# Altium project WR_NIC.PrjPcb (part 4 of 6)

## Sheet 12-USB Phy.SchDoc
size C; SheetNumber: 12; SheetTotal: 22
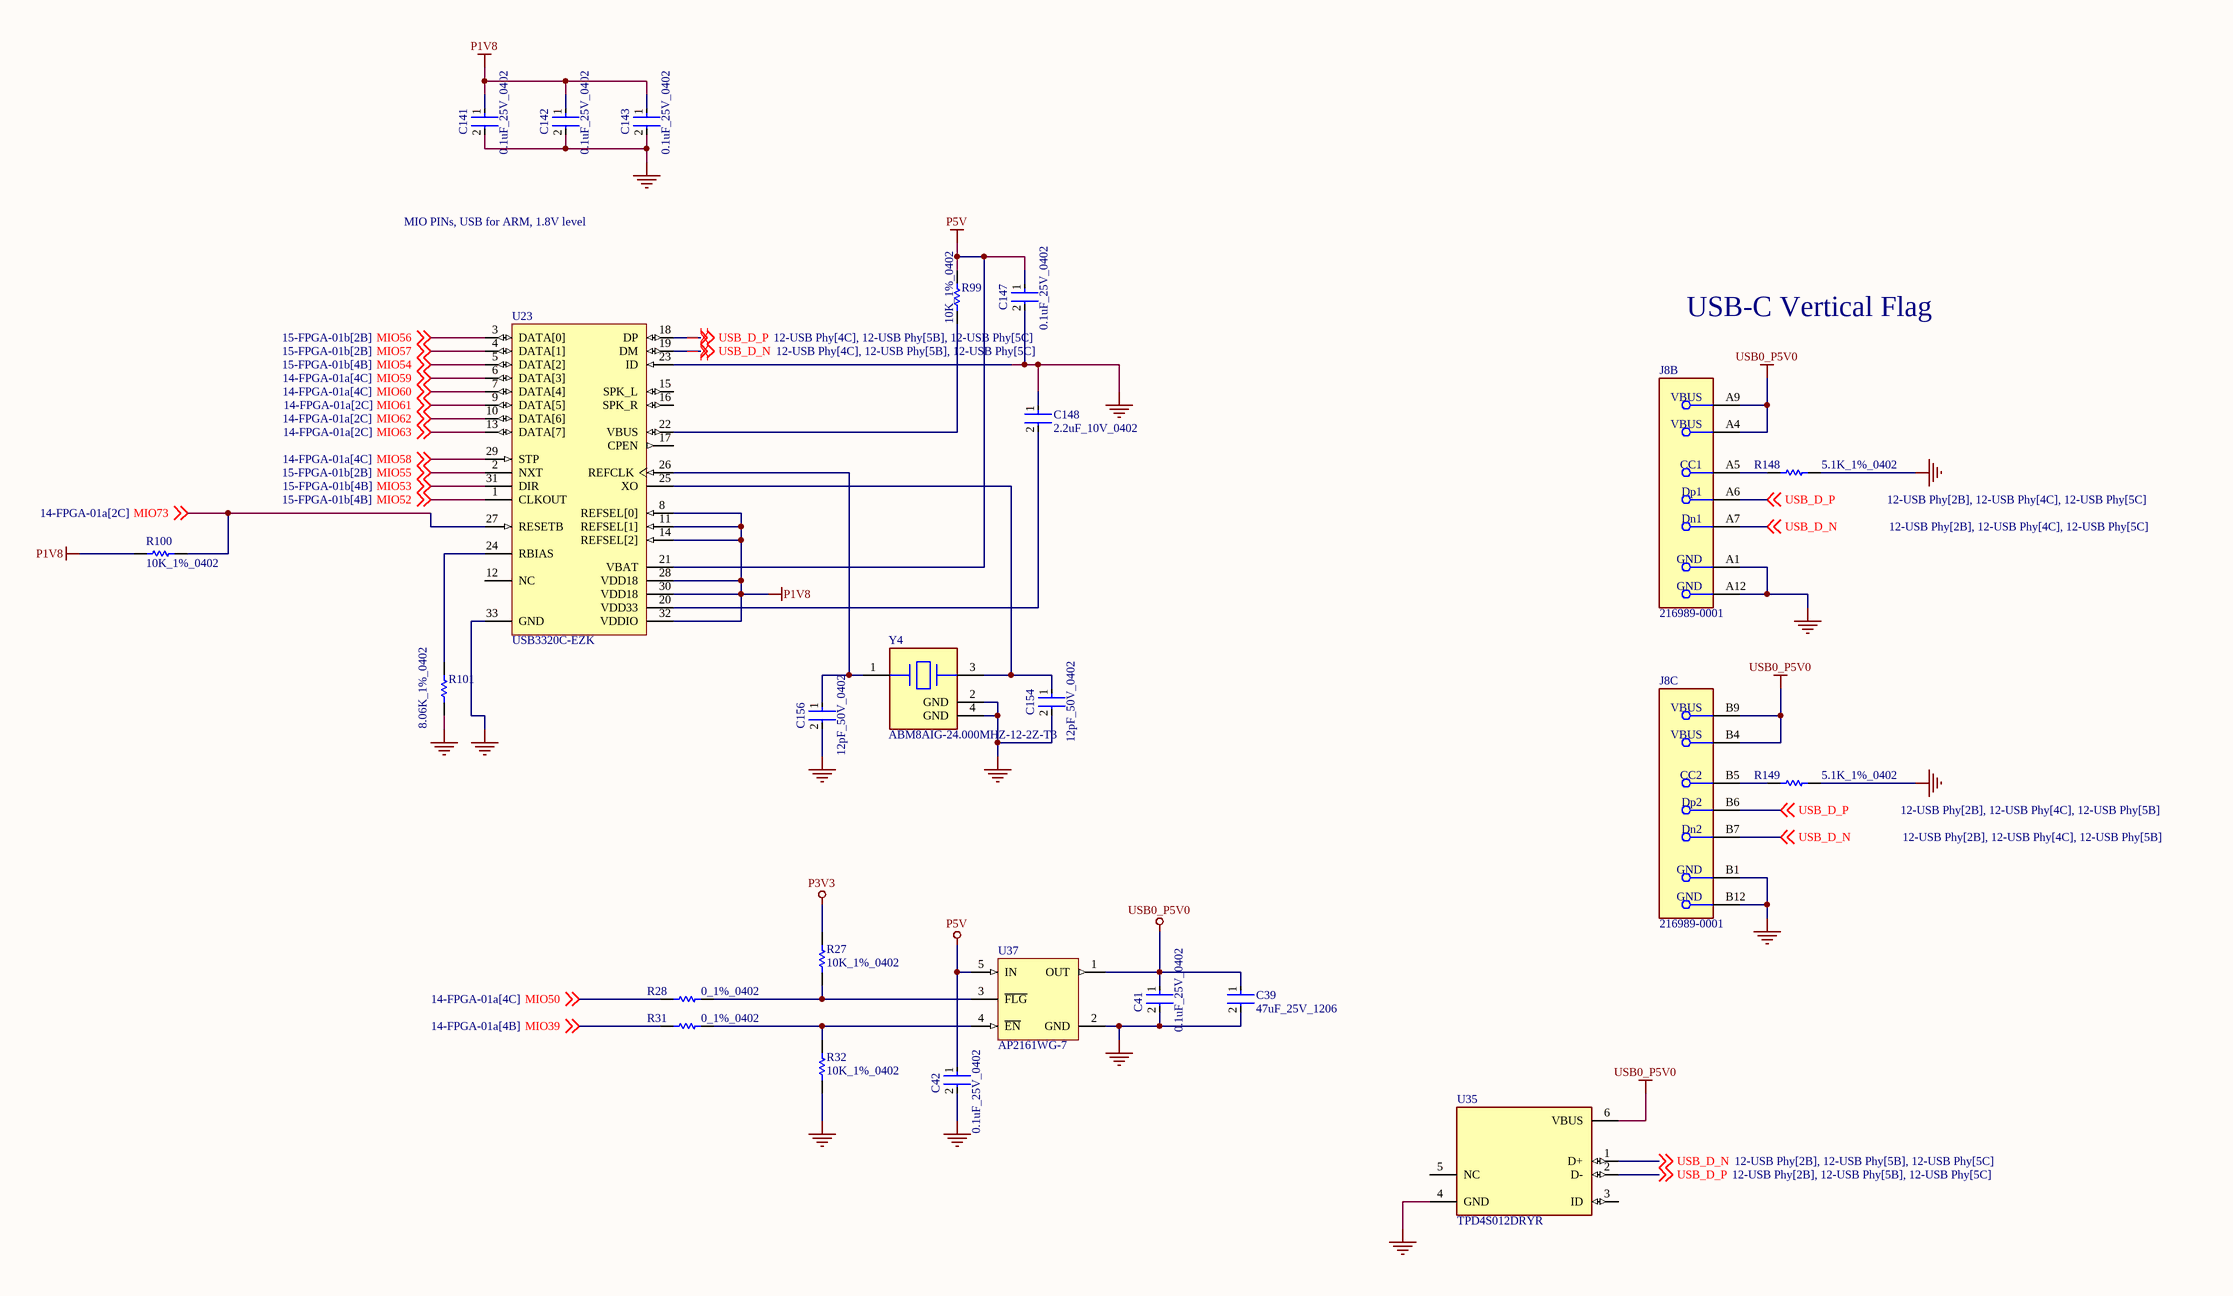
[diagram p12: 12-USB Phy.SchDoc]

### Parts
C39  47uF_25V_1206  [FP-C3216-160-0_2-MFG]
C41  0.1uF_25V_0402  [FP-0402-L_1_0_1-W_0_5_0_1-IPC_C]
C42  0.1uF_25V_0402  [FP-0402-L_1_0_1-W_0_5_0_1-IPC_C]
C141  0.1uF_25V_0402  [FP-0402-L_1_0_1-W_0_5_0_1-IPC_C]
C142  0.1uF_25V_0402  [FP-0402-L_1_0_1-W_0_5_0_1-IPC_C]
C143  0.1uF_25V_0402  [FP-0402-L_1_0_1-W_0_5_0_1-IPC_C]
C147  0.1uF_25V_0402  [FP-0402-L_1_0_1-W_0_5_0_1-IPC_C]
C148  2.2uF_10V_0402  [FP-C1005-050-0_15-0_1-MFG]
C154  12pF_50V_0402  [FP-0402-L_1_0_1-W_0_5_0_1-IPC_B]
C156  12pF_50V_0402  [FP-0402-L_1_0_1-W_0_5_0_1-IPC_B]
J8  216989-0001  [FP-216989-0001-MFG]  (parts B,C of 3)
R27  10K_1%_0402  [RESC1005X40X25NL10T10]
R28  0_1%_0402  [RESC1005X40X25LL05T05]
R31  0_1%_0402  [RESC1005X40X25LL05T05]
R32  10K_1%_0402  [RESC1005X40X25NL10T10]
R99  10K_1%_0402  [RESC1005X40X25NL10T10]
R100  10K_1%_0402  [RESC1005X40X25NL10T10]
R101  8.06K_1%_0402  [RESC1005X40X25ML05T05]
R148  5.1K_1%_0402  [RESC1005X40X25ML10T10]
R149  5.1K_1%_0402  [RESC1005X40X25ML10T10]
U23  USB3320C-EZK  [MCHP-QFN-32-5x5_V2]
U35  TPD4S012DRYR  [FP-DRY0006A-MFG]
U37  AP2161WG-7  [DIOD-SOT25-5_V]
Y4  ABM8AIG-24.000MHZ-12-2Z-T3  [FP-ABM8AIG-MFG]

### Nets
GND: C39.2 C41.2 C42.2 C141.2 C142.2 C143.2 C147.2 C148.1 C154.2 C156.2 J8.A1(GND) J8.A12(GND) J8.B1(GND) J8.B12(GND) R32.1 R101.1 R148.2 R149.2 U23.23(ID) U23.33(GND) U35.4(GND) U37.2(GND) Y4.2(GND) Y4.4(GND)
P1V8: C141.1 C142.1 C143.1 R100.1 U23.8(REFSEL[0]) U23.11(REFSEL[1]) U23.14(REFSEL[2]) U23.28(VDD18) U23.30(VDD18) U23.32(VDDIO)
P3V3: R27.2
P5V: C42.1 C147.1 R99.2 U23.21(VBAT) U37.5(IN)
USB0_P5V0: C39.1 C41.1 J8.A4(VBUS) J8.A9(VBUS) J8.B4(VBUS) J8.B9(VBUS) U35.6(VBUS) U37.1(OUT)
MIO39: R31.1 ; off-sheet MIO39
MIO50: R28.1 ; off-sheet MIO50
MIO52: U23.1(CLKOUT) ; off-sheet MIO52
MIO53: U23.31(DIR) ; off-sheet MIO53
MIO54: U23.5(DATA[2]) ; off-sheet MIO54
MIO55: U23.2(NXT) ; off-sheet MIO55
MIO56: U23.3(DATA[0]) ; off-sheet MIO56
MIO57: U23.4(DATA[1]) ; off-sheet MIO57
MIO58: U23.29(STP) ; off-sheet MIO58
MIO59: U23.6(DATA[3]) ; off-sheet MIO59
MIO60: U23.7(DATA[4]) ; off-sheet MIO60
MIO61: U23.9(DATA[5]) ; off-sheet MIO61
MIO62: U23.10(DATA[6]) ; off-sheet MIO62
MIO63: U23.13(DATA[7]) ; off-sheet MIO63
MIO73: R100.2 U23.27(RESETB) ; off-sheet MIO73
USB_D_N: J8.A7(Dn1) J8.B7(Dn2) U23.19(DM) U35.1(D+) ; off-sheet USB_D_N
USB_D_P: J8.A6(Dp1) J8.B6(Dp2) U23.18(DP) U35.2(D-) ; off-sheet USB_D_P
NetC148_2: C148.2 U23.20(VDD33)
NetC154_1: C154.1 U23.25(XO) Y4.3
NetC156_1: C156.1 U23.26(REFCLK) Y4.1
NetJ8_A5: J8.A5(CC1) R148.1
NetJ8_B5: J8.B5(CC2) R149.1
NetR27_1: R27.1 R28.2 U37.3(~{FLG})
NetR31_2: R31.2 R32.2 U37.4(~{EN})
NetR99_1: R99.1 U23.22(VBUS)
NetR101_2: R101.2 U23.24(RBIAS)

Not connected (* = marked no-connect by the designer): U23 12(NC) 15(SPK_L) 16(SPK_R) 17(CPEN); U35 3(ID) 5(NC)

### Layout directives
differential pair: USB_D_N, USB_D_P

### Notes on the sheet
- MIO PINs, USB for ARM, 1.8V level
- USB-C Vertical Flag

### Library data of the parts
C39 = CMP-2000-05397-3: Multilayer Ceramic Capacitors 47uF ±20% 25V X5R SMD 1206; Weight: 0.000571oz; Dielectric: X5R; Length: 0.126inch; Voltage Rating: 25V; Case/Package: 1206; Dielectric Material: Ceramic; Min Operating Temperature: -55°C; Lead Free: Lead Free; Packaging: Tape and Reel; Package Quantity: 1; Mount: Surface Mount; Depth: 1.6mm; REACH SVHC: No SVHC; Termination: SMD/SMT; Case Code (Imperial): 1206; Series: C; Resistor Type: Ceramic; Voltage: 25V; Width: 0.063inch; Height: 1.6mm; Tolerance: 20%; Capacitance: 47uF; Max Operating Temperature: 85°C; Voltage Rating (DC): 25V; RoHS Compliant: Yes; Thickness: 0.071inch; Case Code (Metric): 3216
C41 C42 C141-C143 C147 = CMP-2008-02519-2: as C91 on sheet 10-JTAG; Package Quantity: 1; Capacitance: 100nF; Min Operating Temperature: -55°C; Voltage: 25V; Voltage Rating: 25V; Construction: Flat; Max Operating Temperature: 125°C; Radiation Hardening: No; Depth: 0.5mm; Thickness: 0.022inch; Voltage Rating (DC): 25V; Number of Pins: 2; Lead Free: Lead Free; Series: -; REACH SVHC: No SVHC; Length: 1mm; Dielectric: X7R; RoHS Compliant: Yes; Mount: Surface Mount; Packaging: Tape and Reel; Case/Package: 0402; Case Code (Imperial): 0402; Termination: SMD/SMT; Width: 0.02inch; Case Code (Metric): 1005; Tolerance: 10%
C148 = CMP-08246-004344-1: CAP CER 2.2UF 10V X7S 0402; Dielectric Material: Ceramic; Tolerance: 10%; Mount: Surface Mount; Height: 0.5mm; Package Quantity: 1; Depth: 0.5mm; RoHS Compliant: Yes; Length: 1mm; Thickness: 0.022inch; Packaging: Tape and Reel; Capacitance: 2.2uF; Case Code (Imperial): 0402; Resistor Type: Ceramic; Dielectric: X7S; Case/Package: 0402; Min Operating Temperature: -55°C; Voltage Rating: 10V; Series: C; Weight: 2.3E-05oz; Width: 0.02inch; Voltage Rating (DC): 10V; Case Code (Metric): 1005; Max Operating Temperature: 125°C; Termination: SMD/SMT; Lead Free: Lead Free
C154 C156 = CMP-2008-02574-2: General Purpose Ceramic Capacitor, 0402, 12pF, 5%, C0G, 30ppm/°C, 50V; Insulation Resistance: 100GR; Radiation Hardening: No; RoHS Compliant: Yes; Voltage Rating: 50V; Case Code (Imperial): 0402; Height: 0.5mm; Voltage: 50V; Voltage Rating (DC): 50V; Mount: Surface Mount; Capacitance: 12pF; Thickness: 0.022inch; Depth: 0.5mm; Max Operating Temperature: 125°C; Construction: Flat; Termination: SMD/SMT; Tolerance: 5%; Length: 1mm; Lead Free: Lead Free; Dielectric: C0G; Number of Pins: 2; Package Quantity: 1; Series: -; Temperature Coefficient: 30ppm/°C; Min Operating Temperature: -55°C; Case/Package: 0402; Packaging: Tape and Reel; Case Code (Metric): 1005; Width: 0.02inch; REACH SVHC: No SVHC
J8 = CMP-04767-000020-1: CONN RCPT USB2.0 TYPE C 24POS RA
R27 R32 R99 R100 = CMP-2002-04694-1: Manufacturer: Bourns; Part Number: CR0402-FX-1002GLF
R28 R31 = CMP-2000-07451-1: as R197-R199 on sheet 09-DPLL-3; Number of Terminations: 2; Mount: SurfaceMount; Height: 0.35mm; Packaging: TapeandReel; Contact Plating: Tin; Manufacturer URL: http://www.panasonic.com/; Composition: ThickFilm; Max Operating Temperature: 155degC; REACH SVHC: NoSVHC; Case/Package: 0402; Package Reference: 402; Depth: 0.5mm; Package Description: 2-Pin Surface Mount Device, Body 1 x 0.5 mm; Datasheet URL: https://industrial.panasonic.com/cdbs/www-data/pdf/RDA0000/AOA0000C301.pdf; RoHSCompliant: True; Case Code (Imperial): 0402; Military Standard: Not; Min Operating Temperature: -55degC; Power Rating: 100mW; Datasheet Version: 03/2015; Length: 1mm; Case Code (Metric): 1005; Termination: SMD/SMT; Mounting Technology: SurfaceMount; Voltage Rating: 50V; Width: 0.02inch; Package Quantity: 1; Lead Free: LeadFree; Radiation Hardening: No
R101 = CMP-2002-00253-3: Chip Resistor, 8.06 KOhm, +/- 1%, 63 mW, -55 to 155 degC, 0402 (1005 Metric), RoHS, Tape and Reel; PartNumber: CRCW04028K06FKED; Manufacturer: Basic Passives; Case\/Package: 0402; Power Rating: 63 mW; Voltage Rating: 50 V; PackageReference: 0402; Radiation Hardening: No; Package Quantity: 10000; Height: 0.35 mm; Packaging: Tape and Reel; Mount: Surface Mount; Length: 1 mm; Weight: 2.3E-05oz; Case Code (Metric): 1005; DatasheetVersion: 06/2012; Pins: 2; Min Operating Temperature: -55 degC; Case Code (Imperial): 0402; REACH SVHC: Unknown; Tolerance: 1%; Mounting Technology: Surface Mount; ComponentLink1URL: http://www.vishay.com/; ComponentLink2URL: http://www.vishay.com/docs/20035/dcrcwe3.pdf; ComponentLink2Description: Datasheet; Resistance: 8.06 KOhm; Max Operating Temperature: 155 degC; ComponentLink1Description: Manufacturer URL; Width: 0.5 mm; RoHSCompliant: true; PackageDescription: 2-Pin Surface Mount Device, Body 1 x 0.5 mm
R148 R149 = CMP-2002-04046-1: as R21 on sheet 10-JTAG
U23 = CMP-0186-00335-1: Highly Integrated Full Featured Hi-Speed USB 2.0 ULPI Transceiver, 1.8 to 3.3 V, -40 to 85 degC, 32-Pin QFN (QFN-3304), RoHS, Tray; Manufacturer: Microchip; VVBAT: 3.1 to 5.5 V; REFCLK Frequency@ULPI Input Clock Mode: 60 MHz; Cpin: 4 pF Max.; VDD33: 3 to 3.6 V; Mounting Technology: Surface Mount; I/O Voltage: 1.8 to 3.3 V; ComponentLink3URL: http://ww1.microchip.com/downloads/en/DeviceDoc/00001792A.pdf; PackageDescription: 32-Pin Quad Flat Non-Leaded Package, Body 5 x 5 mm, Pitch 0.5 mm; ComponentLink2URL: http://ww1.microchip.com/downloads/en/DeviceDoc/00001792A.pdf; Temperature Range: -40 to 85 degC; ComponentLink2Description: Datasheet; ComponentLink1URL: www.microchip.com/; ComponentLink3Description: Package Specification; Packing: Tray; ComponentLink1Description: Manufacturer URL; PartNumber: USB3320C-EZK; PackageVersion: Rev. H; DatasheetVersion: DS00001792A; RoHS: TRUE
U35 = CMP-0326-00038-4: as U33 on sheet 10-JTAG; Max Operating Temperature: 85°C; Packaging: Tape and Reel; Termination: SMD/SMT; Number of Pins: 6; Radiation Hardening: No; Width: 1.05mm; REACH SVHC: No SVHC; Lead Free: Lead Free; Depth: 1mm; Package Quantity: 5000; Length: 1.45mm; Direction: Unidirectional; Min Operating Temperature: -40°C; Number of Channels: 4; Max Power Dissipation: 60W; Height: 0.55mm
U37 = CMP-2000-05781-1: Single Channel Current-limited Power Switch / , 1 A, 2.7 to 5.5 V, -40 to 85 degC, 5-Pin SOT25, RoHS, Tape and Reel; Manufacturer: Diodes-Incorporated; Voltage - Supply (Vcc/Vdd): NotRequired; Interface: On/Off; Ratio - Input: Output:1:1; Input Type: Non-Inverting; Fault Protection: CurrentLimiting(Fixed),OverTemperature,ReverseCurrent,UVLO; Voltage - Load: 2.7V~5.5V; Number of Outputs: 1; Current - Output (Max): 1A; Output Configuration: HighSide; Output Type: P-Channel; Rds On (Typ): 95mOhm; Switch Type: USBSwitch; Family: PMIC-PowerDistributionSwitches,LoadDrivers; Package Reference: SOT25-5; Operating Temperature: -40°C~85°C(TA); Category: IntegratedCircuits(ICs); Datasheet URL: https://www.diodes.com/assets/Datasheets/AP2161_71.pdf; Manufacturer URL: http://www.diodes.com/; Package Description: 5-Pin Small Outline Transistor, Body 3 x 1.6 mm, Pitch 0.95 mm; Mounting Technology: SurfaceMount; Packaging: Tape&Reel(TR); Datasheet Version: Rev. 9-2, 08/2015; Supplier Device Package: SOT-25; Package / Case: SC-74A,SOT-753; Features: StatusFlag; Series: -
Y4 = CMP-27762-015716-1: Crystal 24MHz ±20ppm (Tol) ±50ppm (Stability) 12pF FUND 50Ω Automotive 4-Pin Ultra Mini-CSMD T/R; ESR (Equivalent Series Resistance): 50R; Series: ABM8AIG; RoHS Compliant: Yes; Load Capacitance: 12pF; Height: 0.031inch; Min Operating Temperature: -40°C; Mount: Surface Mount; Packaging: Cut Tape; Ratings: AEC-Q200; Case/Package: SMD/SMT; Frequency Stability: 50ppm; Max Operating Temperature: 125°C; Length: 0.126inch; Frequency: 24MHz; Frequency Tolerance: 20ppm; Width: 0.098inch

## Sheet 13-Experimental.SchDoc
size B; SheetNumber: 13; SheetTotal: 22
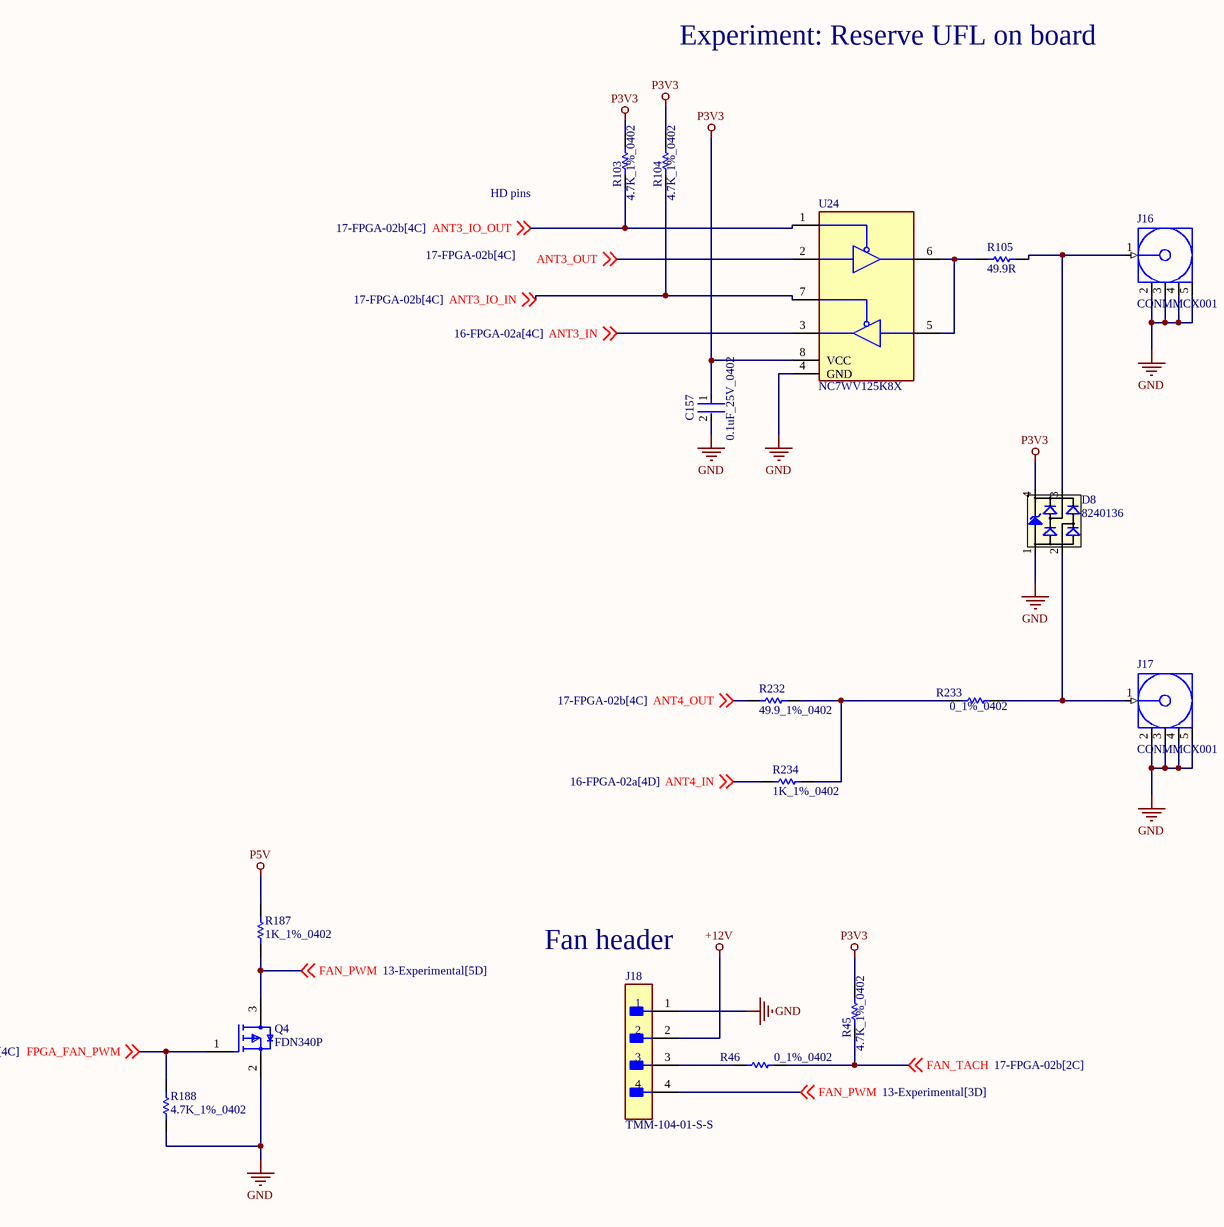
[diagram p13: 13-Experimental.SchDoc]

### Parts
C157  0.1uF_25V_0402  [FP-0402-L_1_0_1-W_0_5_0_1-IPC_C]
D8  8240136  [SOT143-4L]
J16  CONMMCX001  [CON-MMCX]
J17  CONMMCX001  [CON-MMCX]
J18  TMM-104-01-S-S  [FP-TMM-104-01-S-S-MFG]
Q4  FDN340P  [FP-527AG-MFG]
R45  4.7K_1%_0402  [RESC1005X40X25NL10T10]
R46  0_1%_0402  [RESC1005X40X25LL05T05]
R103  4.7K_1%_0402  [RESC1005X40X25NL10T10]
R104  4.7K_1%_0402  [RESC1005X40X25NL10T10]
R105  49.9R  [RESC1608X55X25NL10T15]
R187  1K_1%_0402  [RESC1005X40X25NL05T05]
R188  4.7K_1%_0402  [RESC1005X40X25NL10T10]
R232  49.9_1%_0402  [RESC1005X40X25NL10T10]
R233  0_1%_0402  [RESC1005X40X25LL05T05]
R234  1K_1%_0402  [RESC1005X40X25NL05T05]
U24  NC7WV125K8X  [SOP50P310X90-8N]

### Nets
+12V: J18.2
GND: C157.2 D8.1(GND) J16.2(GND) J16.3(GND) J16.4(GND) J16.5(GND) J17.2(GND) J17.3(GND) J17.4(GND) J17.5(GND) J18.1 Q4.2(S) R188.1 U24.4(GND)
P3V3: C157.1 D8.4(VDD) R45.1 R103.1 R104.1 U24.8(VCC)
P5V: R187.2
ANT3_IN: U24.3 ; off-sheet ANT3_IN
ANT3_IO_IN: R104.2 U24.7 ; off-sheet ANT3_IO_IN
ANT3_IO_OUT: R103.2 U24.1 ; off-sheet ANT3_IO_OUT
ANT3_OUT: U24.2 ; off-sheet ANT3_OUT
ANT4_IN: R234.1 ; off-sheet ANT4_IN
ANT4_OUT: R232.1 ; off-sheet ANT4_OUT
FAN_PWM: J18.4 Q4.3(D) R187.1 ; off-sheet FAN_PWM
FAN_TACH: R45.2 R46.2 ; off-sheet FAN_TACH
FPGA_FAN_PWM: Q4.1(G) R188.2 ; off-sheet FPGA_FAN_PWM
NetD8_2: D8.2(I/O1) J17.1(Signal) R233.2
NetD8_3: D8.3(I/O2) J16.1(Signal) R105.2
NetJ18_3: J18.3 R46.1
NetR105_1: R105.1 U24.5 U24.6
NetR232_2: R232.2 R233.1 R234.2

### Notes on the sheet
- Experiment: Reserve UFL on board
- HD pins
- Fan header

### Library data of the parts
C157 = CMP-2008-02519-2: as C91 on sheet 10-JTAG; Package Quantity: 1; Capacitance: 100nF; Min Operating Temperature: -55°C; Voltage: 25V; Voltage Rating: 25V; Construction: Flat; Max Operating Temperature: 125°C; Radiation Hardening: No; Depth: 0.5mm; Thickness: 0.022inch; Voltage Rating (DC): 25V; Number of Pins: 2; Lead Free: Lead Free; Series: -; REACH SVHC: No SVHC; Length: 1mm; Dielectric: X7R; RoHS Compliant: Yes; Mount: Surface Mount; Packaging: Tape and Reel; Case/Package: 0402; Case Code (Imperial): 0402; Termination: SMD/SMT; Width: 0.02inch; Case Code (Metric): 1005; Tolerance: 10%
D8 = CMP-1486-00002-1: as D18 on sheet 09-DPLL-3; PartNumber: 8240136; ComponentLink1Description: Manufacturer URL; PackageReference: SOT143-4L; ComponentLink1URL: http://www.we-online.com; ComponentLink2Description: Datasheet; ComponentLink2URL: http://katalog.we-online.de/kataloge/eisos/media/pdf/8240136.pdf
J16 J17 = CMP-0168-00018-1: MMCX Female PCB Mount Connector, Thru-Hole; PCB_Layout: Pads complies with manufacturer's recommendation.; PackageReference: CON-MMCX; PackageDescription: MMCX Female PCB Mount Connector, Thru-Hole, 3.5 x 3.5 mm Body; DatasheetVersion: rev1.0, Jun-2006; PackageVersion: rev1.0, Jun-2006
J18 = CMP-02766-001674-1: CONN HEADER VERT 4POS 2MM; Max Current Rating: 3.9A; Connector Type: Male Pin; Max Voltage Rating (AC): 500V; Number of Contacts: 4; Gender: Male; Color: Black; Packaging: Bulk; Orientation: Straight; Contact Mating Length: 0.126inch; Contact Plating: Gold; Max Operating Temperature: 125°C; Housing Color: Black; Contact Material: Bronze; Package Quantity: 1; Housing Material: Polymer; Radiation Hardening: No; Pitch: 2mm; Contact Type: Male Pin; Number of Positions: 4; Number of Rows: 1; Lead Free: Lead Free; Width: 1.97mm; Termination: Solder; Depth: 1.97mm; Series: FleXYZ™ TMM; RoHS Compliant: Yes; Length: 8mm; Min Operating Temperature: -55°C; Mount: Through Hole
Q4 = CMP-2100-03638-2: MOSFET P-CH 20V 2A SSOT3; Fall Time: 11ns; Rise Time: 9ns; Voltage Rating (DC): -20V; Power Dissipation: 500mW; Nominal Vgs: -800mV; Current Rating: -2A; Gate to Source Voltage (Vgs): 8V; Rds On Max: 70mR; Turn-Off Delay Time: 27ns; Element Configuration: Single; Number of Elements: 1; Input Capacitance: 779pF; Drain to Source Resistance: 60mR; Turn-On Delay Time: 10ns; Package Quantity: 1; Mount: Surface Mount; Case/Package: SOT-23; Min Operating Temperature: -55°C; REACH SVHC: No SVHC; Weight: 0.03g; Packaging: Tape and Reel; Threshold Voltage: -800mV; Max Operating Temperature: 150°C; Dual Supply Voltage: -20V; Termination: SMD/SMT; Drain to Source Voltage (Vdss): 20V; Height: 0.94mm; Length: 2.92mm; Contact Plating: Tin; Width: 3.05mm; Drain to Source Breakdown Voltage: -20V; Max Power Dissipation: 500mW; Continuous Drain Current (ID): 2A; Number of Pins: 3; Lead Free: Lead Free; Radiation Hardening: No; On-State Resistance: 70MR
R45 R103 R104 R188 = CMP-2002-05217-1: as R246-R250 on sheet 09-DPLL-3
R46 R233 = CMP-2000-07451-1: as R197-R199 on sheet 09-DPLL-3; Number of Terminations: 2; Mount: SurfaceMount; Height: 0.35mm; Packaging: TapeandReel; Contact Plating: Tin; Manufacturer URL: http://www.panasonic.com/; Composition: ThickFilm; Max Operating Temperature: 155degC; REACH SVHC: NoSVHC; Case/Package: 0402; Package Reference: 402; Depth: 0.5mm; Package Description: 2-Pin Surface Mount Device, Body 1 x 0.5 mm; Datasheet URL: https://industrial.panasonic.com/cdbs/www-data/pdf/RDA0000/AOA0000C301.pdf; RoHSCompliant: True; Case Code (Imperial): 0402; Military Standard: Not; Min Operating Temperature: -55degC; Power Rating: 100mW; Datasheet Version: 03/2015; Length: 1mm; Case Code (Metric): 1005; Termination: SMD/SMT; Mounting Technology: SurfaceMount; Voltage Rating: 50V; Width: 0.02inch; Package Quantity: 1; Lead Free: LeadFree; Radiation Hardening: No
R105 = CMP-1659-00036-1: as R244 on sheet 09-DPLL-3; PackageReference: 0603; Packaging: Tray; ComponentLink2Description: Datasheet; ComponentLink1Description: Manufacturer URL; ComponentLink2URL: https://datasheet.ciiva.com/11808/0900766b80f96399-11808223.pdf; RoHSCompliant: true; Max Operating Temperature: 85 degC; ComponentLink1URL: http://www.yageo.com/; PackageDescription: 2-Pin Surface Mount Device, Body 1.6 x 0.8 mm; DatasheetVersion: Rev. 4, 04/2009; Min Operating Temperature: -40 degC; Package Quantity: 250; Pins: 48
R187 R234 = CMP-2002-08277-1: as R78 on sheet 10-JTAG
R232 = CMP-2002-04448-1: as R195 on sheet 09-DPLL-3
U24 = NC7WV125K8X: Integrated Circuit; Manufacturer_Name: ON Semiconductor; Datasheet Link: https://www.mouser.com/datasheet/2/308/NC7WV125-1301459.pdf; Height: 0.9mm; Manufacturer_Part_Number: NC7WV125K8X; Mouser Part Number: 512-NC7WV125K8X; Mouser Price/Stock: https://www.mouser.com/Search/Refine.aspx?Keyword=512-NC7WV125K8X; Arrow Part Number: NC7WV125K8X; Arrow Price/Stock: https://www.arrow.com/en/products/nc7wv125k8x/on-semiconductor

## Sheet 14-FPGA-01a.SchDoc
size Tabloid; Customer: 01910; SheetNumber: 14; SheetTotal: 22
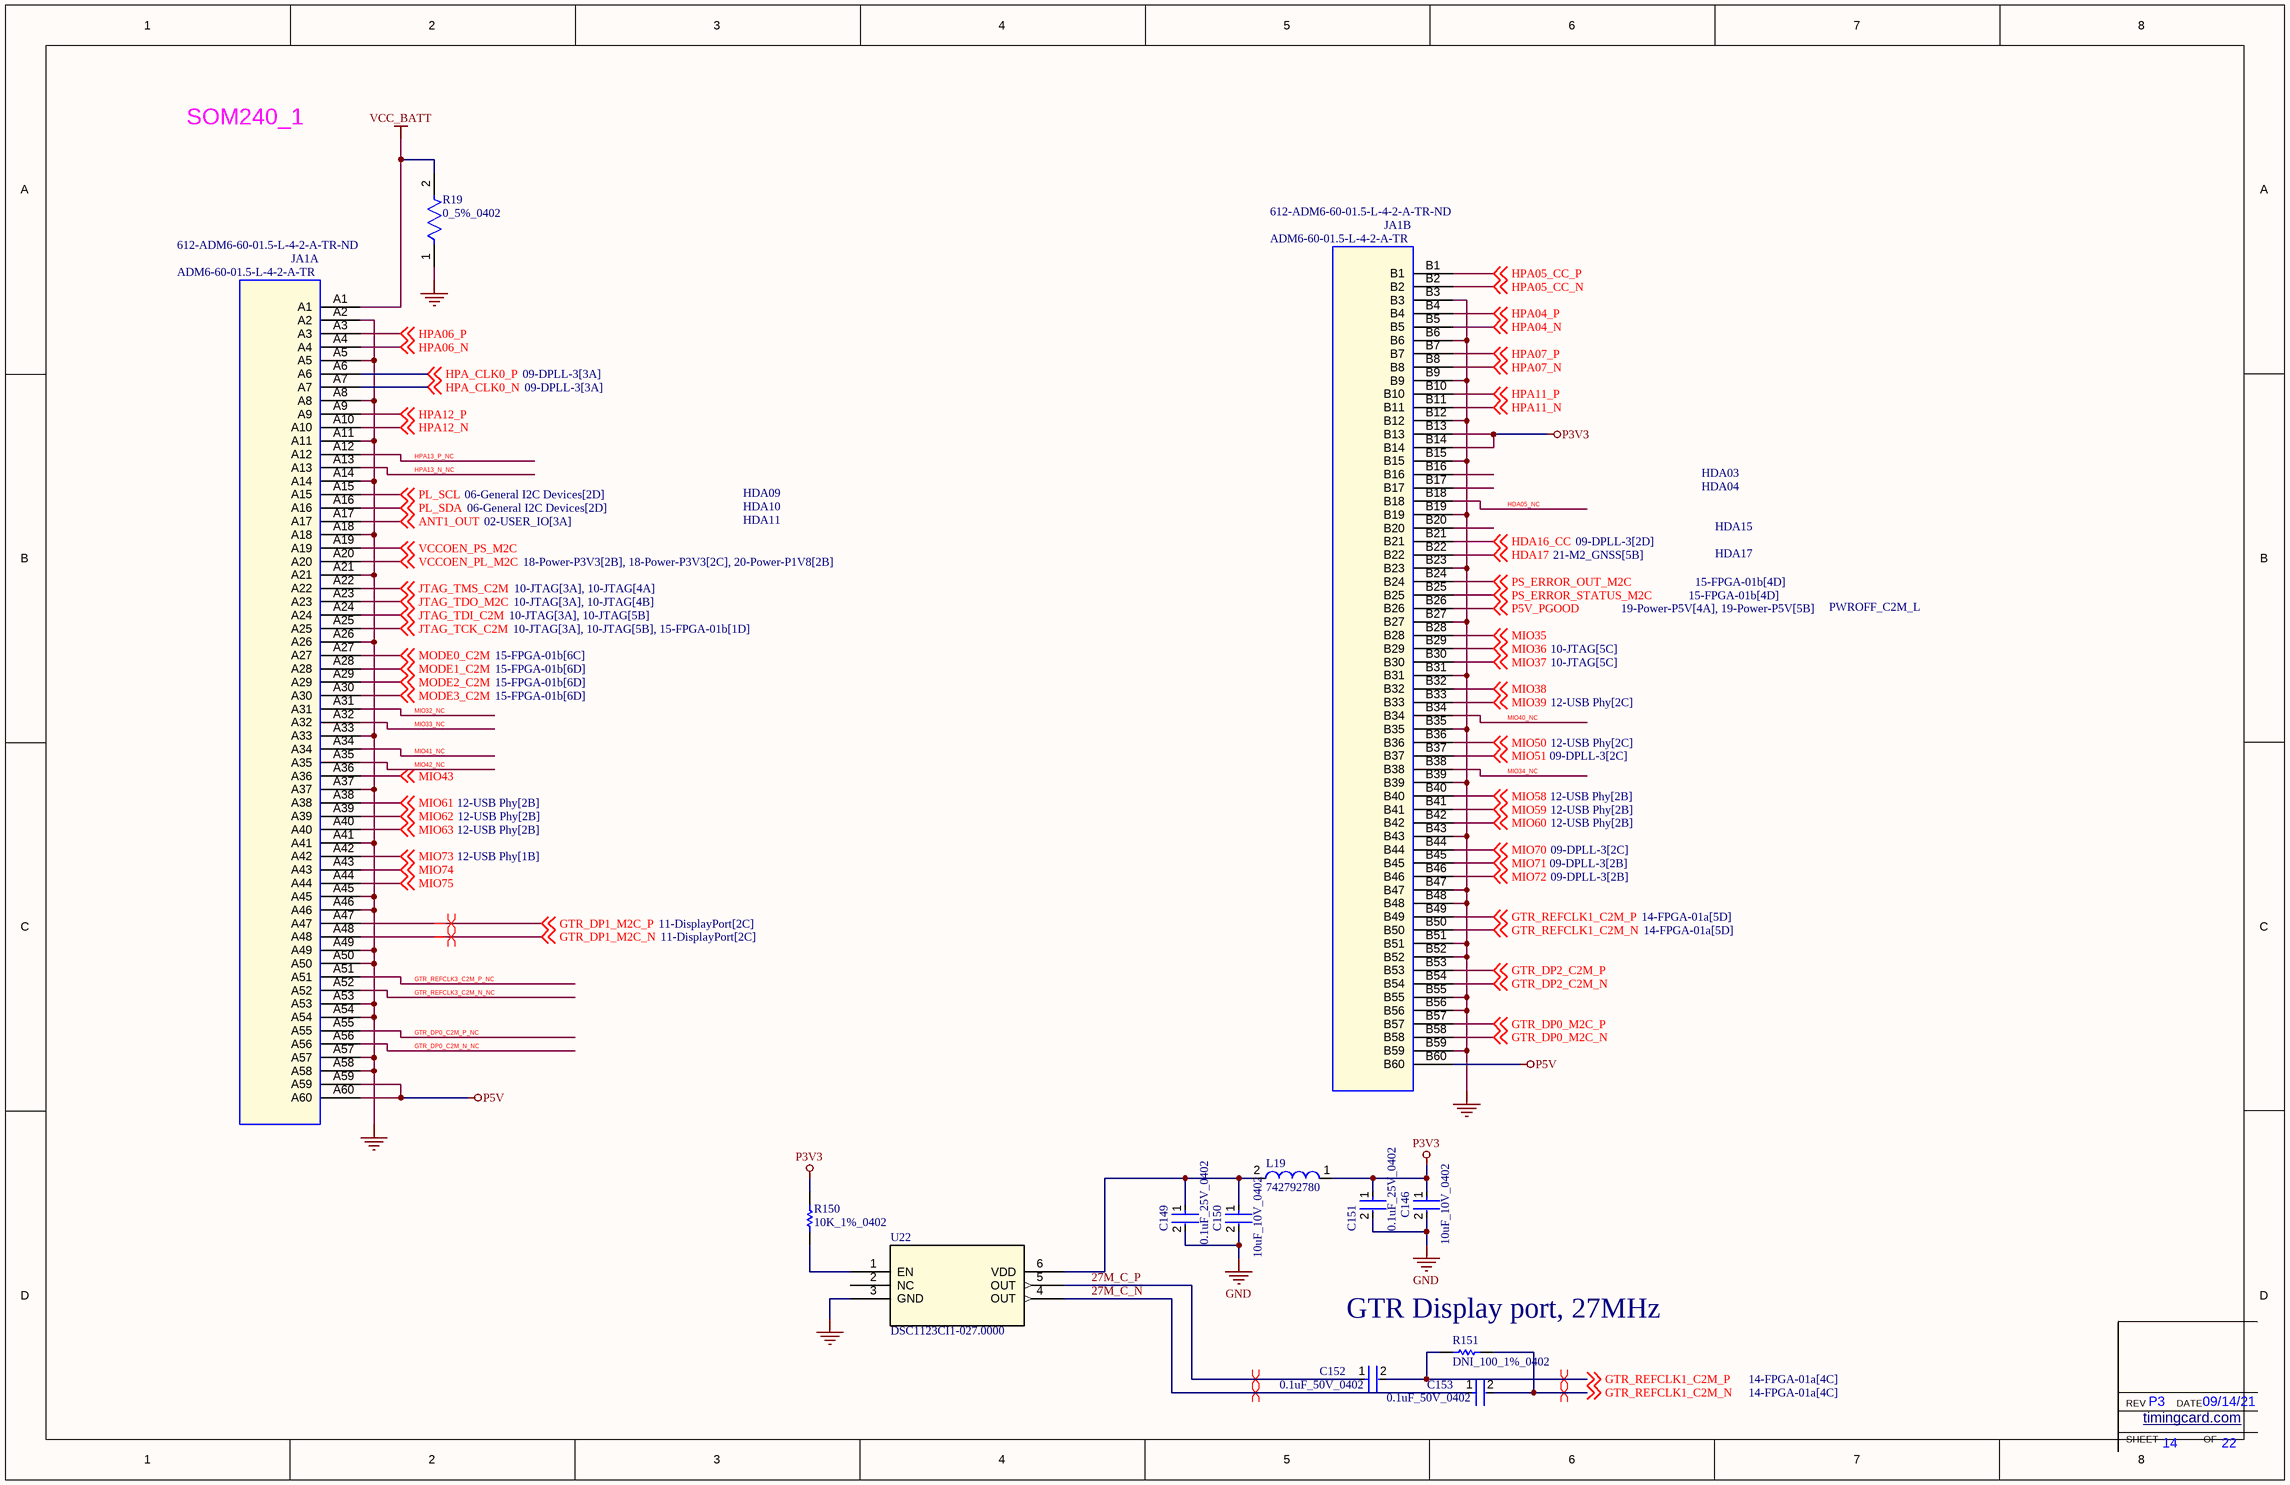
[diagram p14: 14-FPGA-01a.SchDoc]

### Parts
C146  10uF_10V_0402  [FP-CL05A106MP5NUNC-MFG]
C149  0.1uF_25V_0402  [FP-0402-L_1_0_1-W_0_5_0_1-IPC_C]
C150  10uF_10V_0402  [FP-CL05A106MP5NUNC-MFG]
C151  0.1uF_25V_0402  [FP-0402-L_1_0_1-W_0_5_0_1-IPC_C]
C152  0.1uF_50V_0402  [FP-C1005-050-0_05-IPC_C]
C153  0.1uF_50V_0402  [FP-C1005-050-0_05-IPC_C]
JA1  ADM6-60-01.5-L-4-2-A-TR  Supplier Part Number 1: 612-ADM6-60-01.5-L-4-2-A-TR-ND  [CON_SAMTEC_ADM6_60_4]  (parts A,B of 4)
L19  742792780  [SMD-0402]
R19  0_5%_0402  [FP-AC0402-0_37-IPC_B]
R150  10K_1%_0402  [RESC1005X40X25LL05T05]
R151  DNI_100_1%_0402  [RESC1005X40X25ML05T10]  (no BOM)
U22  DSC1123CI1-027.0000  [VDFN6_3P2X2P5_MCH]

### Nets
GND: C146.2 C149.2 C150.2 C151.2 JA1.A2 JA1.A5 JA1.A8 JA1.A11 JA1.A14 JA1.A18 JA1.A21 JA1.A26 JA1.A33 JA1.A37 JA1.A41 JA1.A45 JA1.A46 JA1.A49 JA1.A50 JA1.A53 JA1.A54 JA1.A57 JA1.A58 JA1.B3 JA1.B6 JA1.B9 JA1.B12 JA1.B15 JA1.B19 JA1.B23 JA1.B27 JA1.B31 JA1.B35 JA1.B39 JA1.B43 JA1.B47 JA1.B48 JA1.B51 JA1.B52 JA1.B55 JA1.B56 JA1.B59 R19.1 U22.3(GND)
P3V3: C146.1 C151.1 JA1.B13 JA1.B14 L19.1 R150.2
P5V: JA1.A59 JA1.A60 JA1.B60
VCC_BATT: JA1.A1 R19.2
27M_C_N: C153.1 U22.4(OUT)
27M_C_P: C152.1 U22.5(OUT)
ANT1_OUT: JA1.A17 ; off-sheet ANT1_OUT
GTR_DP0_C2M_N_NC: JA1.A56
GTR_DP0_C2M_P_NC: JA1.A55
GTR_DP0_M2C_N: JA1.B58 ; off-sheet GTR_DP0_M2C_N
GTR_DP0_M2C_P: JA1.B57 ; off-sheet GTR_DP0_M2C_P
GTR_DP1_M2C_N: JA1.A48 ; off-sheet GTR_DP1_M2C_N
GTR_DP1_M2C_P: JA1.A47 ; off-sheet GTR_DP1_M2C_P
GTR_DP2_C2M_N: JA1.B54 ; off-sheet GTR_DP2_C2M_N
GTR_DP2_C2M_P: JA1.B53 ; off-sheet GTR_DP2_C2M_P
GTR_REFCLK1_C2M_N: C153.2 JA1.B50 R151.2 ; off-sheet GTR_REFCLK1_C2M_N
GTR_REFCLK1_C2M_P: C152.2 JA1.B49 R151.1 ; off-sheet GTR_REFCLK1_C2M_P
GTR_REFCLK3_C2M_N_NC: JA1.A52
GTR_REFCLK3_C2M_P_NC: JA1.A51
HDA05_NC: JA1.B18
HDA16_CC: JA1.B21 ; off-sheet HDA16_CC
HDA17: JA1.B22 ; off-sheet HDA17
HPA04_N: JA1.B5 ; off-sheet HPA04_N
HPA04_P: JA1.B4 ; off-sheet HPA04_P
HPA05_CC_N: JA1.B2 ; off-sheet HPA05_CC_N
HPA05_CC_P: JA1.B1 ; off-sheet HPA05_CC_P
HPA06_N: JA1.A4 ; off-sheet HPA06_N
HPA06_P: JA1.A3 ; off-sheet HPA06_P
HPA07_N: JA1.B8 ; off-sheet HPA07_N
HPA07_P: JA1.B7 ; off-sheet HPA07_P
HPA11_N: JA1.B11 ; off-sheet HPA11_N
HPA11_P: JA1.B10 ; off-sheet HPA11_P
HPA12_N: JA1.A10 ; off-sheet HPA12_N
HPA12_P: JA1.A9 ; off-sheet HPA12_P
HPA13_N_NC: JA1.A13
HPA13_P_NC: JA1.A12
HPA_CLK0_N: JA1.A7 ; off-sheet HPA_CLK0_N
HPA_CLK0_P: JA1.A6 ; off-sheet HPA_CLK0_P
JTAG_TCK_C2M: JA1.A25 ; off-sheet JTAG_TCK_C2M
JTAG_TDI_C2M: JA1.A24 ; off-sheet JTAG_TDI_C2M
JTAG_TDO_M2C: JA1.A23 ; off-sheet JTAG_TDO_M2C
JTAG_TMS_C2M: JA1.A22 ; off-sheet JTAG_TMS_C2M
MIO32_NC: JA1.A31
MIO33_NC: JA1.A32
MIO34_NC: JA1.B38
MIO35: JA1.B28 ; off-sheet MIO35
MIO36: JA1.B29 ; off-sheet MIO36  [project net SOM_UART1_TXD]
MIO37: JA1.B30 ; off-sheet MIO37  [project net SOM_UART1_RXD]
MIO38: JA1.B32 ; off-sheet MIO38
MIO39: JA1.B33 ; off-sheet MIO39
MIO40_NC: JA1.B34
MIO41_NC: JA1.A34
MIO42_NC: JA1.A35
MIO43: JA1.A36 ; off-sheet MIO43
MIO50: JA1.B36 ; off-sheet MIO50
MIO51: JA1.B37 ; off-sheet MIO51
MIO58: JA1.B40 ; off-sheet MIO58
MIO59: JA1.B41 ; off-sheet MIO59
MIO60: JA1.B42 ; off-sheet MIO60
MIO61: JA1.A38 ; off-sheet MIO61
MIO62: JA1.A39 ; off-sheet MIO62
MIO63: JA1.A40 ; off-sheet MIO63
MIO70: JA1.B44 ; off-sheet MIO70
MIO71: JA1.B45 ; off-sheet MIO71
MIO72: JA1.B46 ; off-sheet MIO72
MIO73: JA1.A42 ; off-sheet MIO73
MIO74: JA1.A43 ; off-sheet MIO74
MIO75: JA1.A44 ; off-sheet MIO75
MODE0_C2M: JA1.A27 ; off-sheet MODE0_C2M
MODE1_C2M: JA1.A28 ; off-sheet MODE1_C2M
MODE2_C2M: JA1.A29 ; off-sheet MODE2_C2M
MODE3_C2M: JA1.A30 ; off-sheet MODE3_C2M
P5V_PGOOD: JA1.B26 ; off-sheet P5V_PGOOD
PL_SCL: JA1.A15 ; off-sheet PL_SCL
PL_SDA: JA1.A16 ; off-sheet PL_SDA
PS_ERROR_OUT_M2C: JA1.B24 ; off-sheet PS_ERROR_OUT_M2C
PS_ERROR_STATUS_M2C: JA1.B25 ; off-sheet PS_ERROR_STATUS_M2C
VCCOEN_PL_M2C: JA1.A20 ; off-sheet VCCOEN_PL_M2C
VCCOEN_PS_M2C: JA1.A19 ; off-sheet VCCOEN_PS_M2C
NetC149_1: C149.1 C150.1 L19.2 U22.6(VDD)
NetR150_1: R150.1 U22.1(EN)

Not connected (* = marked no-connect by the designer): JA1 B16 B17 B20; U22 2(NC)

### Layout directives
differential pair: 27M_C_N, 27M_C_P, GTR_DP1_M2C_N, GTR_DP1_M2C_P, GTR_REFCLK1_C2M_N, GTR_REFCLK1_C2M_P

### Notes on the sheet
- SOM240_1
- HDA09
- HDA03
- HDA04
- HDA10
- HDA11
- HDA15
- HDA17
- PWROFF_C2M_L
- (near R151) GTR Display port, 27MHz
- SHEET
- REV
- timingcard.com <http://timingcard.com>
- DATE
- OF

### Library data of the parts
C146 C150 = CMP-13271-000002-1: CAP CER 10UF 10V X5R 0402; Manufacturer Part Number: CL05A106MP5NUNC; Manufacturer: Samsung; Temperature Coefficient: 15%; Tolerance: 20%; Material: Ceramic; Octopart: https://octopart.com/cl05a106mp5nunc-samsung-22457395; Voltage Rating: 10V; RoHS: TRUE; Value: 10uF; Height: 0.7mm; Digikey Description: CAP CER 10UF 10V X5R 0402; Automotive: No; Package: CL05A106MP5NUNC; Device Class L1: Passive Components; Capacitance: 10uF; Temperature Range High: +85°C; ComponentLink2Description: Datasheet; Device Class L2: Capacitors; Temperature Characteristic: X5R; Temperature: -55°C to +85°C; ComponentLink2URL: http://www.samsungsem.com/kr/support/product-search/mlcc/__icsFiles/afieldfile/2019/05/10/19-CL05A106MP5NUNC.pdf; Device Class L3: Ceramic Capacitors; Category: Cap; Temperature Range Low: -55°C; Ipc Land Pattern Name: CAPC10050X50; Lead Free: Yes
C149 C151 = CMP-2008-02519-2: as C91 on sheet 10-JTAG; Package Quantity: 1; Capacitance: 100nF; Min Operating Temperature: -55°C; Voltage: 25V; Voltage Rating: 25V; Construction: Flat; Max Operating Temperature: 125°C; Radiation Hardening: No; Depth: 0.5mm; Thickness: 0.022inch; Voltage Rating (DC): 25V; Number of Pins: 2; Lead Free: Lead Free; Series: -; REACH SVHC: No SVHC; Length: 1mm; Dielectric: X7R; RoHS Compliant: Yes; Mount: Surface Mount; Packaging: Tape and Reel; Case/Package: 0402; Case Code (Imperial): 0402; Termination: SMD/SMT; Width: 0.02inch; Case Code (Metric): 1005; Tolerance: 10%
C152 C153 = CMP-2000-05393-2: as C266 on sheet 09-DPLL-3; Voltage: 50V; Dielectric Material: Ceramic; Min Operating Temperature: -55°C; Depth: 0.5mm; Radiation Hardening: No; RoHS Compliant: Yes; Voltage Rating (DC): 50V; Lead Free: Lead Free; Resistor Type: Ceramic; Height: 0.5mm; Dielectric: X7R; Thickness: 0.022inch; Case/Package: 0402; Case Code (Metric): 1005; Termination: SMD/SMT; Capacitance: 100nF; Packaging: Tape and Reel; Max Operating Temperature: 125°C; Mount: Surface Mount; Package Quantity: 1; Width: 0.02inch; Weight: 2.3E-05oz; Voltage Rating: 50V; Tolerance: 10%; Construction: Flat; Case Code (Imperial): 0402; Length: 1mm; REACH SVHC: No SVHC; Series: C
JA1 = SAMTEC-ADx6-60X4: Conn Rcpt Male Vert 240 Pos 4x60 0.635mm P Black SMT; Manufacturer: Samtec Inc.; Agile Part Number: CON-00383-01; SPLIT_INST: TRUE; SWAP_INFO: (S1+S2+S3+S4); Pitch: 0.025" (0.64mm); Barcode: 40000092; Datasheet: http://suddendocs.samtec.com/catalog_english/adf6.pdf; Manufacturer PN: ADM6-60-01.5-L-4-2-A-TR; PCB Footprint: CON_SAMTEC_ADM6_60_4; CIP Link: http://xsjbrdwin1/CIP-E/Component/Index/All?pn=40000092; Number of Pins: 240; Part Type: CONNECTOR; Supplier 1: Digi-Key
L19 = CMP-0220-00137-1: SMD EMI Suppression Ferrite Bead WE-CBF, Z = 220 Ohm; Impedance: 220 Ohm; PackageVersion: 2009; DatasheetVersion: ver 4, Jul-2009; PackageDescription: Chip Inductor, 2-Leads, Body 1.0 x 0.5 mm; ComponentLink1URL: http://www.we-online.com; ComponentLink1Description: Manufacturer Link; ComponentLink2URL: http://www.we-online.de/katalog/media/pdf/742792780.pdf; PackageReference: SMD-0402; ComponentLink2Description: Datasheet
R19 = CMP-2002-01772-2: as R245 on sheet 09-DPLL-3; Min Operating Temperature: -55°C; Termination: SMD/SMT; Case/Package: 0402; Case Code (Imperial): 0402; Packaging: Tape and Reel; Case Code (Metric): 1005; Max Operating Temperature: 155°C; Series: AC
R150 = CMP-2000-07588-1: Chip Resistor, 10 KOhm, +/- 1%, 0.1 W, -55 to 155 degC, 0402 (1005 Metric), RoHS, Tape and Reel; Manufacturer: Panasonic; Power Rating: 100mW; Voltage Rating: 50V; Resistance: 10KOhm; Case\/Package: 0402; Temperature Coefficient: 100ppm\/degreesC; RoHSCompliant: True; Lead Free: LeadFree; Package Quantity: 1; Contact Plating: Tin; Length: 1mm; Radiation Hardening: No; REACH SVHC: NoSVHC; Max Operating Temperature: 155degC; Depth: 0.5mm; Case Code (Imperial): 0402; Military Standard: Not; Package Description: 2-Pin Surface Mount Device, Body 1 x 0.5 mm; Termination: SMD/SMT; Case Code (Metric): 1005; Height: 0.35mm; Packaging: TapeandReel; Voltage Rating (DC): 50V; Package Reference: 402; Number of Pins: 2; Tolerance: 1%; Mounting Technology: SurfaceMount; Width: 0.02inch; Mount: SurfaceMount; Datasheet URL: https://industrial.panasonic.com/cdbs/www-data/pdf/RDA0000/AOA0000C304.pdf; Composition: ThickFilm; Datasheet Version: 02/2017; Manufacturer URL: http://www.panasonic.com/; Max Power Dissipation: 100mW; Number of Terminations: 2; Min Operating Temperature: -55degC
R151 = CMP-2002-06458-1: as R110 on sheet 09-DPLL-3
U22 = DSC1123CI1-027.0000: No Description Available; Mfr_Name: Microchip; RefDes: RefDes; Type: Type

## Sheet 15-FPGA-01b.SchDoc
size B; SheetNumber: 15; SheetTotal: 22
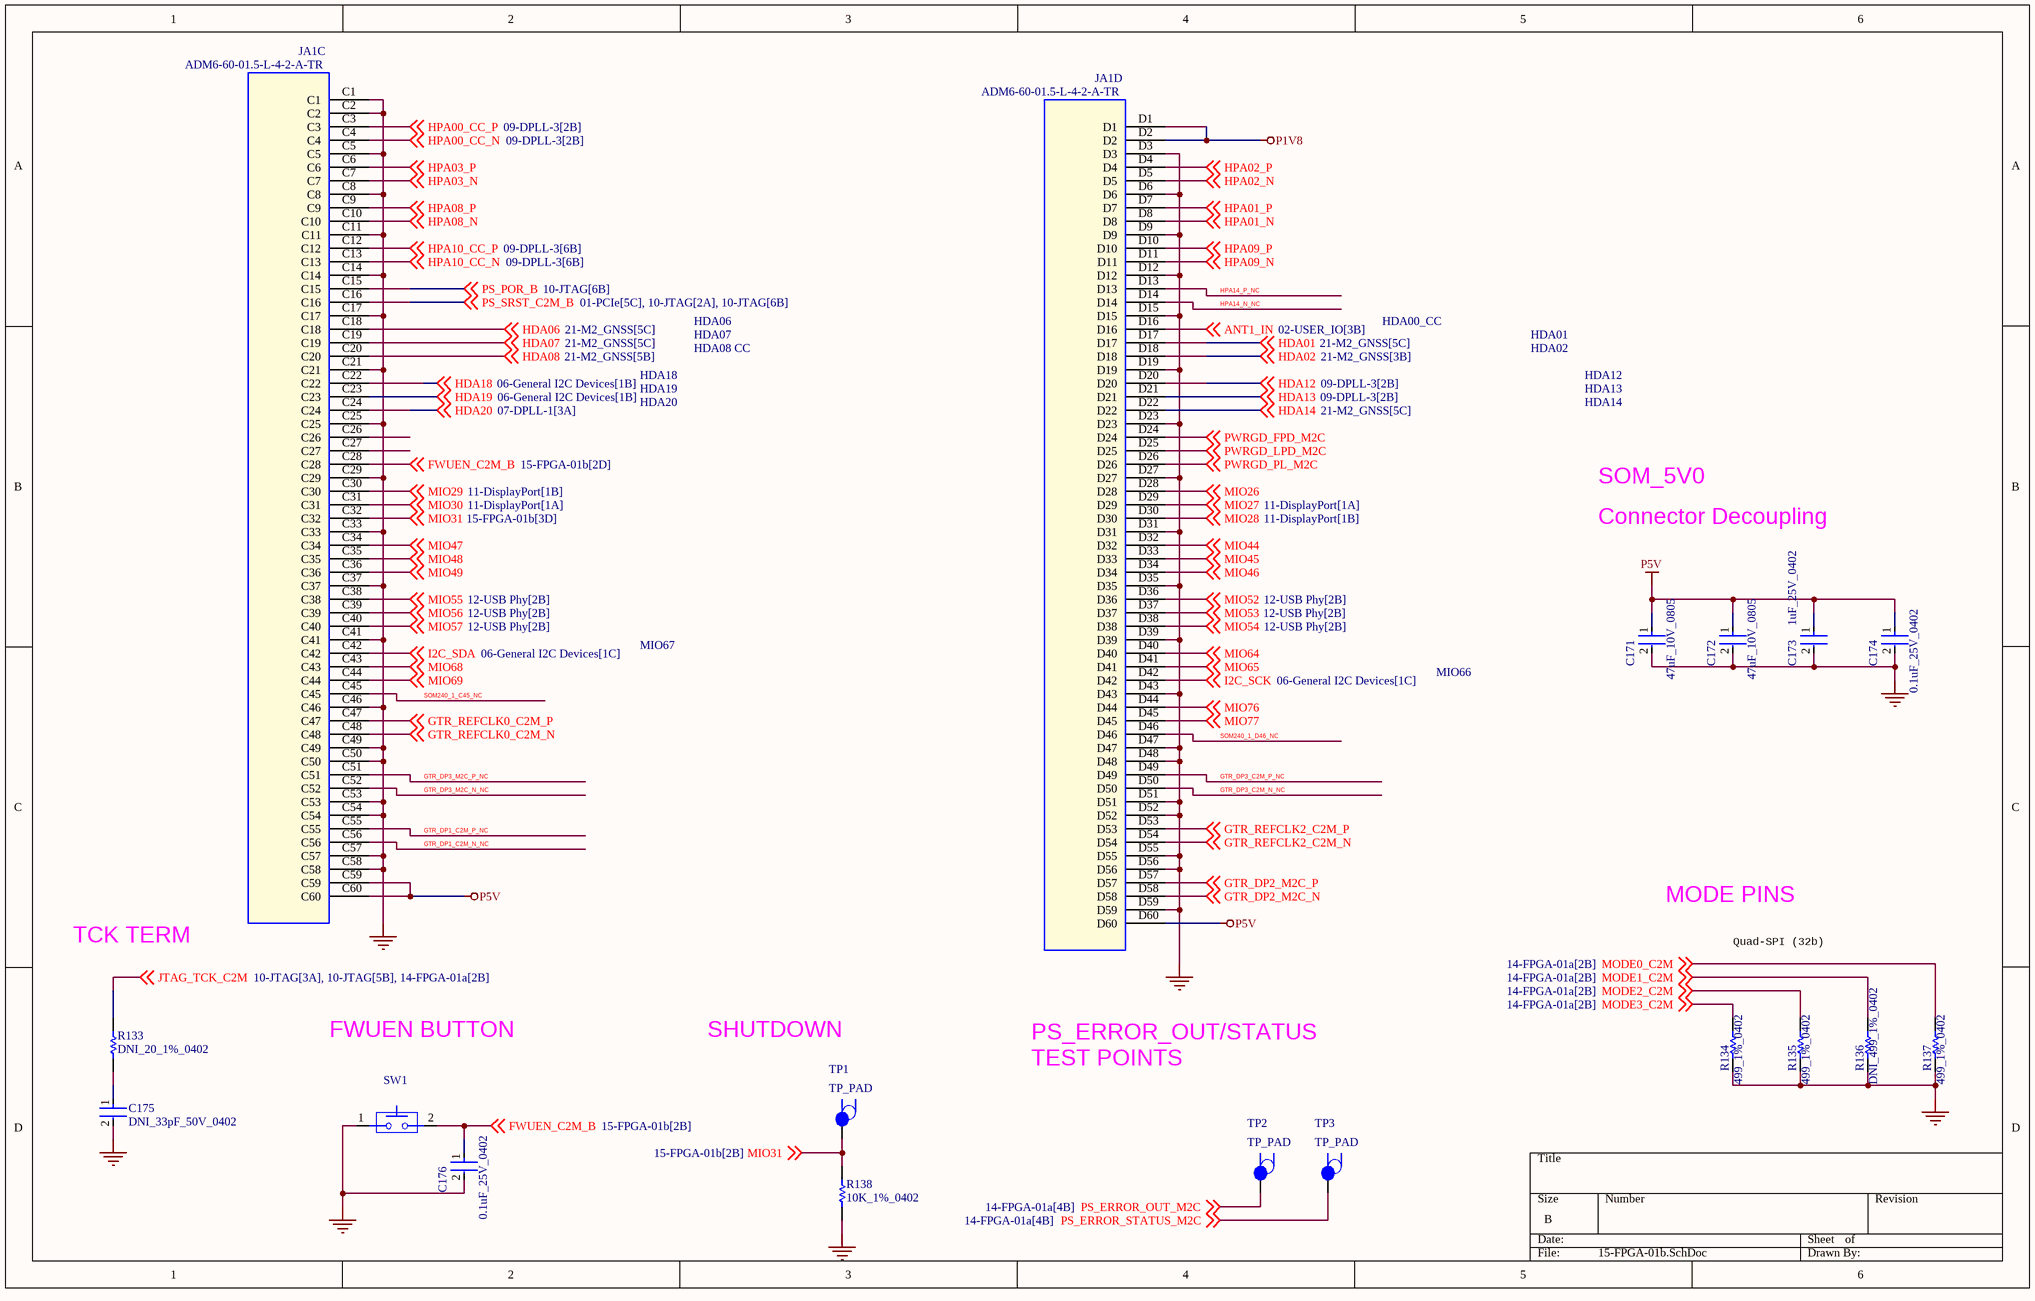
[diagram p15: 15-FPGA-01b.SchDoc]

### Parts
C171  47uF_10V_0805  [FP-GRM21B-0_2-e0_2_0_7-IPC_A]
C172  47uF_10V_0805  [FP-GRM21B-0_2-e0_2_0_7-IPC_A]
C173  1uF_25V_0402  [FP-CL542-IPC_C]
C174  0.1uF_25V_0402  [FP-0402-L_1_0_0_05-W_0_5-IPC_B]
C175  DNI_33pF_50V_0402  [FP-C1005-050-0_05-IPC_A]  (no BOM)
C176  0.1uF_25V_0402  [FP-0402-L_1_0_0_05-W_0_5-IPC_B]
JA1  ADM6-60-01.5-L-4-2-A-TR  [CON_SAMTEC_ADM6_60_4]  (parts C,D of 4)
R133  DNI_20_1%_0402  [RESC1005X40X25NL10T10]  (no BOM)
R134  499_1%_0402  [RESC1005X40X25LL05T05]
R135  499_1%_0402  [RESC1005X40X25LL05T05]
R136  DNI_499_1%_0402  [RESC1005X40X25LL05T05]  (no BOM)
R137  499_1%_0402  [RESC1005X40X25LL05T05]
R138  10K_1%_0402  [RESC1005X40X25ML05T05]
SW1  B3U-1000P  [SW_OMRON_2P]  (value not drawn)
TP1  TP_PAD  [TP_PAD]
TP2  TP_PAD  [TP_PAD]
TP3  TP_PAD  [TP_PAD]

### Nets
GND: C171.2 C172.2 C173.2 C174.2 C175.2 C176.2 JA1.C1 JA1.C2 JA1.C5 JA1.C8 JA1.C11 JA1.C14 JA1.C17 JA1.C21 JA1.C25 JA1.C29 JA1.C33 JA1.C37 JA1.C41 JA1.C46 JA1.C49 JA1.C50 JA1.C53 JA1.C54 JA1.C57 JA1.C58 JA1.D3 JA1.D6 JA1.D9 JA1.D12 JA1.D15 JA1.D19 JA1.D23 JA1.D27 JA1.D31 JA1.D35 JA1.D39 JA1.D43 JA1.D47 JA1.D48 JA1.D51 JA1.D52 JA1.D55 JA1.D56 JA1.D59 R134.1 R135.1 R136.1 R137.1 R138.1 SW1.1(SW1)
P1V8: JA1.D1 JA1.D2
P5V: C171.1 C172.1 C173.1 C174.1 JA1.C59 JA1.C60 JA1.D60
ANT1_IN: JA1.D16 ; off-sheet ANT1_IN
FWUEN_C2M_B: C176.1 JA1.C28 SW1.2(SW2) ; off-sheet FWUEN_C2M_B
GTR_DP1_C2M_N_NC: JA1.C56
GTR_DP1_C2M_P_NC: JA1.C55
GTR_DP2_M2C_N: JA1.D58 ; off-sheet GTR_DP2_M2C_N
GTR_DP2_M2C_P: JA1.D57 ; off-sheet GTR_DP2_M2C_P
GTR_DP3_C2M_N_NC: JA1.D50
GTR_DP3_C2M_P_NC: JA1.D49
GTR_DP3_M2C_N_NC: JA1.C52
GTR_DP3_M2C_P_NC: JA1.C51
GTR_REFCLK0_C2M_N: JA1.C48 ; off-sheet GTR_REFCLK0_C2M_N
GTR_REFCLK0_C2M_P: JA1.C47 ; off-sheet GTR_REFCLK0_C2M_P
GTR_REFCLK2_C2M_N: JA1.D54 ; off-sheet GTR_REFCLK2_C2M_N
GTR_REFCLK2_C2M_P: JA1.D53 ; off-sheet GTR_REFCLK2_C2M_P
HDA01: JA1.D17 ; off-sheet HDA01
HDA02: JA1.D18 ; off-sheet HDA02
HDA06: JA1.C18 ; off-sheet HDA06
HDA07: JA1.C19 ; off-sheet HDA07
HDA08: JA1.C20 ; off-sheet HDA08
HDA12: JA1.D20 ; off-sheet HDA12
HDA13: JA1.D21 ; off-sheet HDA13
HDA14: JA1.D22 ; off-sheet HDA14
HDA18: JA1.C22 ; off-sheet HDA18
HDA19: JA1.C23 ; off-sheet HDA19
HDA20: JA1.C24 ; off-sheet HDA20
HPA00_CC_N: JA1.C4 ; off-sheet HPA00_CC_N
HPA00_CC_P: JA1.C3 ; off-sheet HPA00_CC_P
HPA01_N: JA1.D8 ; off-sheet HPA01_N
HPA01_P: JA1.D7 ; off-sheet HPA01_P
HPA02_N: JA1.D5 ; off-sheet HPA02_N
HPA02_P: JA1.D4 ; off-sheet HPA02_P
HPA03_N: JA1.C7 ; off-sheet HPA03_N
HPA03_P: JA1.C6 ; off-sheet HPA03_P
HPA08_N: JA1.C10 ; off-sheet HPA08_N
HPA08_P: JA1.C9 ; off-sheet HPA08_P
HPA09_N: JA1.D11 ; off-sheet HPA09_N
HPA09_P: JA1.D10 ; off-sheet HPA09_P
HPA10_CC_N: JA1.C13 ; off-sheet HPA10_CC_N
HPA10_CC_P: JA1.C12 ; off-sheet HPA10_CC_P
HPA14_N_NC: JA1.D14
HPA14_P_NC: JA1.D13
I2C_SCK: JA1.D42 ; off-sheet I2C_SCK
I2C_SDA: JA1.C42 ; off-sheet I2C_SDA
JTAG_TCK_C2M: R133.2 ; off-sheet JTAG_TCK_C2M
MIO26: JA1.D28 ; off-sheet MIO26
MIO27: JA1.D29 ; off-sheet MIO27
MIO28: JA1.D30 ; off-sheet MIO28
MIO29: JA1.C30 ; off-sheet MIO29
MIO30: JA1.C31 ; off-sheet MIO30
MIO31: JA1.C32 R138.2 TP1.1(TP) ; off-sheet MIO31
MIO44: JA1.D32 ; off-sheet MIO44
MIO45: JA1.D33 ; off-sheet MIO45
MIO46: JA1.D34 ; off-sheet MIO46
MIO47: JA1.C34 ; off-sheet MIO47
MIO48: JA1.C35 ; off-sheet MIO48
MIO49: JA1.C36 ; off-sheet MIO49
MIO52: JA1.D36 ; off-sheet MIO52
MIO53: JA1.D37 ; off-sheet MIO53
MIO54: JA1.D38 ; off-sheet MIO54
MIO55: JA1.C38 ; off-sheet MIO55
MIO56: JA1.C39 ; off-sheet MIO56
MIO57: JA1.C40 ; off-sheet MIO57
MIO64: JA1.D40 ; off-sheet MIO64
MIO65: JA1.D41 ; off-sheet MIO65
MIO68: JA1.C43 ; off-sheet MIO68
MIO69: JA1.C44 ; off-sheet MIO69
MIO76: JA1.D44 ; off-sheet MIO76
MIO77: JA1.D45 ; off-sheet MIO77
MODE0_C2M: R137.2 ; off-sheet MODE0_C2M
MODE1_C2M: R136.2 ; off-sheet MODE1_C2M
MODE2_C2M: R135.2 ; off-sheet MODE2_C2M
MODE3_C2M: R134.2 ; off-sheet MODE3_C2M
PS_ERROR_OUT_M2C: TP2.1(TP) ; off-sheet PS_ERROR_OUT_M2C
PS_ERROR_STATUS_M2C: TP3.1(TP) ; off-sheet PS_ERROR_STATUS_M2C
PS_POR_B: JA1.C15 ; off-sheet PS_POR_B
PS_SRST_C2M_B: JA1.C16 ; off-sheet PS_SRST_C2M_B
PWRGD_FPD_M2C: JA1.D24 ; off-sheet PWRGD_FPD_M2C
PWRGD_LPD_M2C: JA1.D25 ; off-sheet PWRGD_LPD_M2C
PWRGD_PL_M2C: JA1.D26 ; off-sheet PWRGD_PL_M2C
SOM240_1_C45_NC: JA1.C45
SOM240_1_D46_NC: JA1.D46
NetC175_1: C175.1 R133.1

Not connected (* = marked no-connect by the designer): JA1 C26 C27

### Notes on the sheet
- HDA06
- HDA07
- HDA08 CC
- HDA00_CC
- HDA01
- HDA02
- HDA18
- HDA19
- HDA20
- HDA12
- HDA13
- HDA14
- SOM_5V0
- Connector Decoupling
- MIO67
- MIO66
- MODE PINS
- TCK TERM
- Quad-SPI (32b)
- FWUEN BUTTON
- SHUTDOWN
- PS_ERROR_OUT/STATUS
  TEST POINTS

### Library data of the parts
C171 C172 = CMP-2000-06341-2: as C132 on sheet 11-DisplayPort; Length: 2mm; Voltage Rating: 10V; Mount: Surface Mount; Width: 0.049inch; Voltage Rating (DC): 10V; Lead Free: Lead Free; REACH SVHC: No SVHC; Termination: SMD/SMT; Case/Package: 0805; Dielectric: X5R; Capacitance: 47uF; Packaging: Tape and Reel; Max Operating Temperature: 85°C; Tolerance: 20%; Thickness: 0.057inch; Dielectric Material: Ceramic; Min Operating Temperature: -55°C; Height: 1.25mm; Case Code (Imperial): 0805; Case Code (Metric): 2012; Depth: 1.25mm; Voltage: 10V
C173 = CMP-13271-001051-1: as C105 on sheet 10-JTAG; Radiation Hardening: No; Lead Free: Lead Free; Capacitance: 1uF; Package Quantity: 10000; Max Operating Temperature: 85°C; Voltage Rating: 25V; Case/Package: 0402; Min Operating Temperature: -55°C; Packaging: Tape and Reel; Tolerance: 10%; Height: 0.5mm; Thickness: 0.022inch; Case Code (Metric): 1005; Width: 0.02inch; Case Code (Imperial): 0402; Dielectric: X5R; Length: 1mm; Mount: Surface Mount; Material: Ceramic; Depth: 0.5mm
C174 C176 = CMP-14477-000014-3: None; Voltage Rating (DC): 25V; Tolerance: 10%; Capacitance: 100nF; Dielectric: X5R; Max Operating Temperature: 85°C; Resistor Type: Ceramic; Packaging: Tape and Reel; Lead Free: Lead Free; Case Code (Imperial): 0402; Thickness: 0.022inch; Series: M; Construction: Flat; Number of Pins: 2; Width: 0.5mm; Halogen Free: Halogen Free; Case/Package: 0402; Voltage: 25V; Height: 0.5mm; Mount: Surface Mount; Min Operating Temperature: -55°C; Case Code (Metric): 1005; Length: 1mm; Depth: 0.5mm; Voltage Rating: 25V; Package Quantity: 1; Weight: 2.3E-05oz; RoHS Compliant: Yes; Termination: SMD/SMT; REACH SVHC: No SVHC
C175 = CMP-08246-002761-1: Multilayer Ceramic Capacitors 33pF ±1% 50V C0G SMD 0402; Weight: 2.3E-05oz; Case/Package: 0402; Mount: Surface Mount; REACH SVHC: No SVHC; Voltage Rating (DC): 50V; Voltage Rating: 50V; Max Operating Temperature: 125°C; Packaging: Tape and Reel; Length: 0.039inch; Dielectric: C0G; Case Code (Imperial): 0402; Height: 0.5mm; Termination: SMD/SMT; Min Operating Temperature: -55°C; Thickness: 0.022inch; Lead Free: Lead Free; Depth: 0.5mm; Dielectric Material: Ceramic; Package Quantity: 1; Case Code (Metric): 1005; Capacitance: 33pF; RoHS Compliant: Yes; Series: C; Width: 0.02inch; Tolerance: 1%
JA1 = SAMTEC-ADx6-60X4: as JA1 on sheet 14-FPGA-01a; Datasheet: http://suddendocs.samtec.com/catalog_english/adf6.pdf; Manufacturer PN: ADM6-60-01.5-L-4-2-A-TR; PCB Footprint: CON_SAMTEC_ADM6_60_4; CIP Link: http://xsjbrdwin1/CIP-E/Component/Index/All?pn=40000092; Number of Pins: 240; Part Type: CONNECTOR
R133 = CMP-2002-05710-1: Manufacturer: TE Connectivity / AMP; Part Number: CRG0402F20R
R134-R137 = CMP-2002-00038-1: Manufacturer: Vishay Dale; Part Number: CRCW0402499RFKTD
R138 = CMP-2002-00433-1: as R68 on sheet 10-JTAG
SW1 = BTN_MOMENT: Switch SPST-NO Mom 50mA 12V 1.6mm H 1.5Nw SMT IP40; Manufacturer: OMRON; Agile Part Number: SWH-00003-01; EDMVersionID: 489329634; Barcode: 440024; Manufacturer PN: B3U-1000P; PCB Footprint: SW_OMRON_2P; CIP Link: http://xsjbrdwin1/CIP-E/Component/Index/All?pn=440024; Part Type: MOMENT
TP1-TP3 = TP: TEST POINT 24mil SM pad; EDMVersionID: 493452275; ASSEMBLY_OPTIONS: DNP; Barcode: 96000010; MANF_P/N: DNP; OWNER: 3709; PCB Footprint: TP_PAD; PartType: TEST POINT; Pins: 1PIN; ROHS: Yes; Datasheet: NA; MANF: DNP; DEVICE: TP_PAD; Part Type: Unassigned Part Type; CIP Link: http://xsjbrdwin1/CIP-E/Component/Index/All?pn=96000010

## Sheet 16-FPGA-02a.SchDoc
size B; SheetNumber: 16; SheetTotal: 22
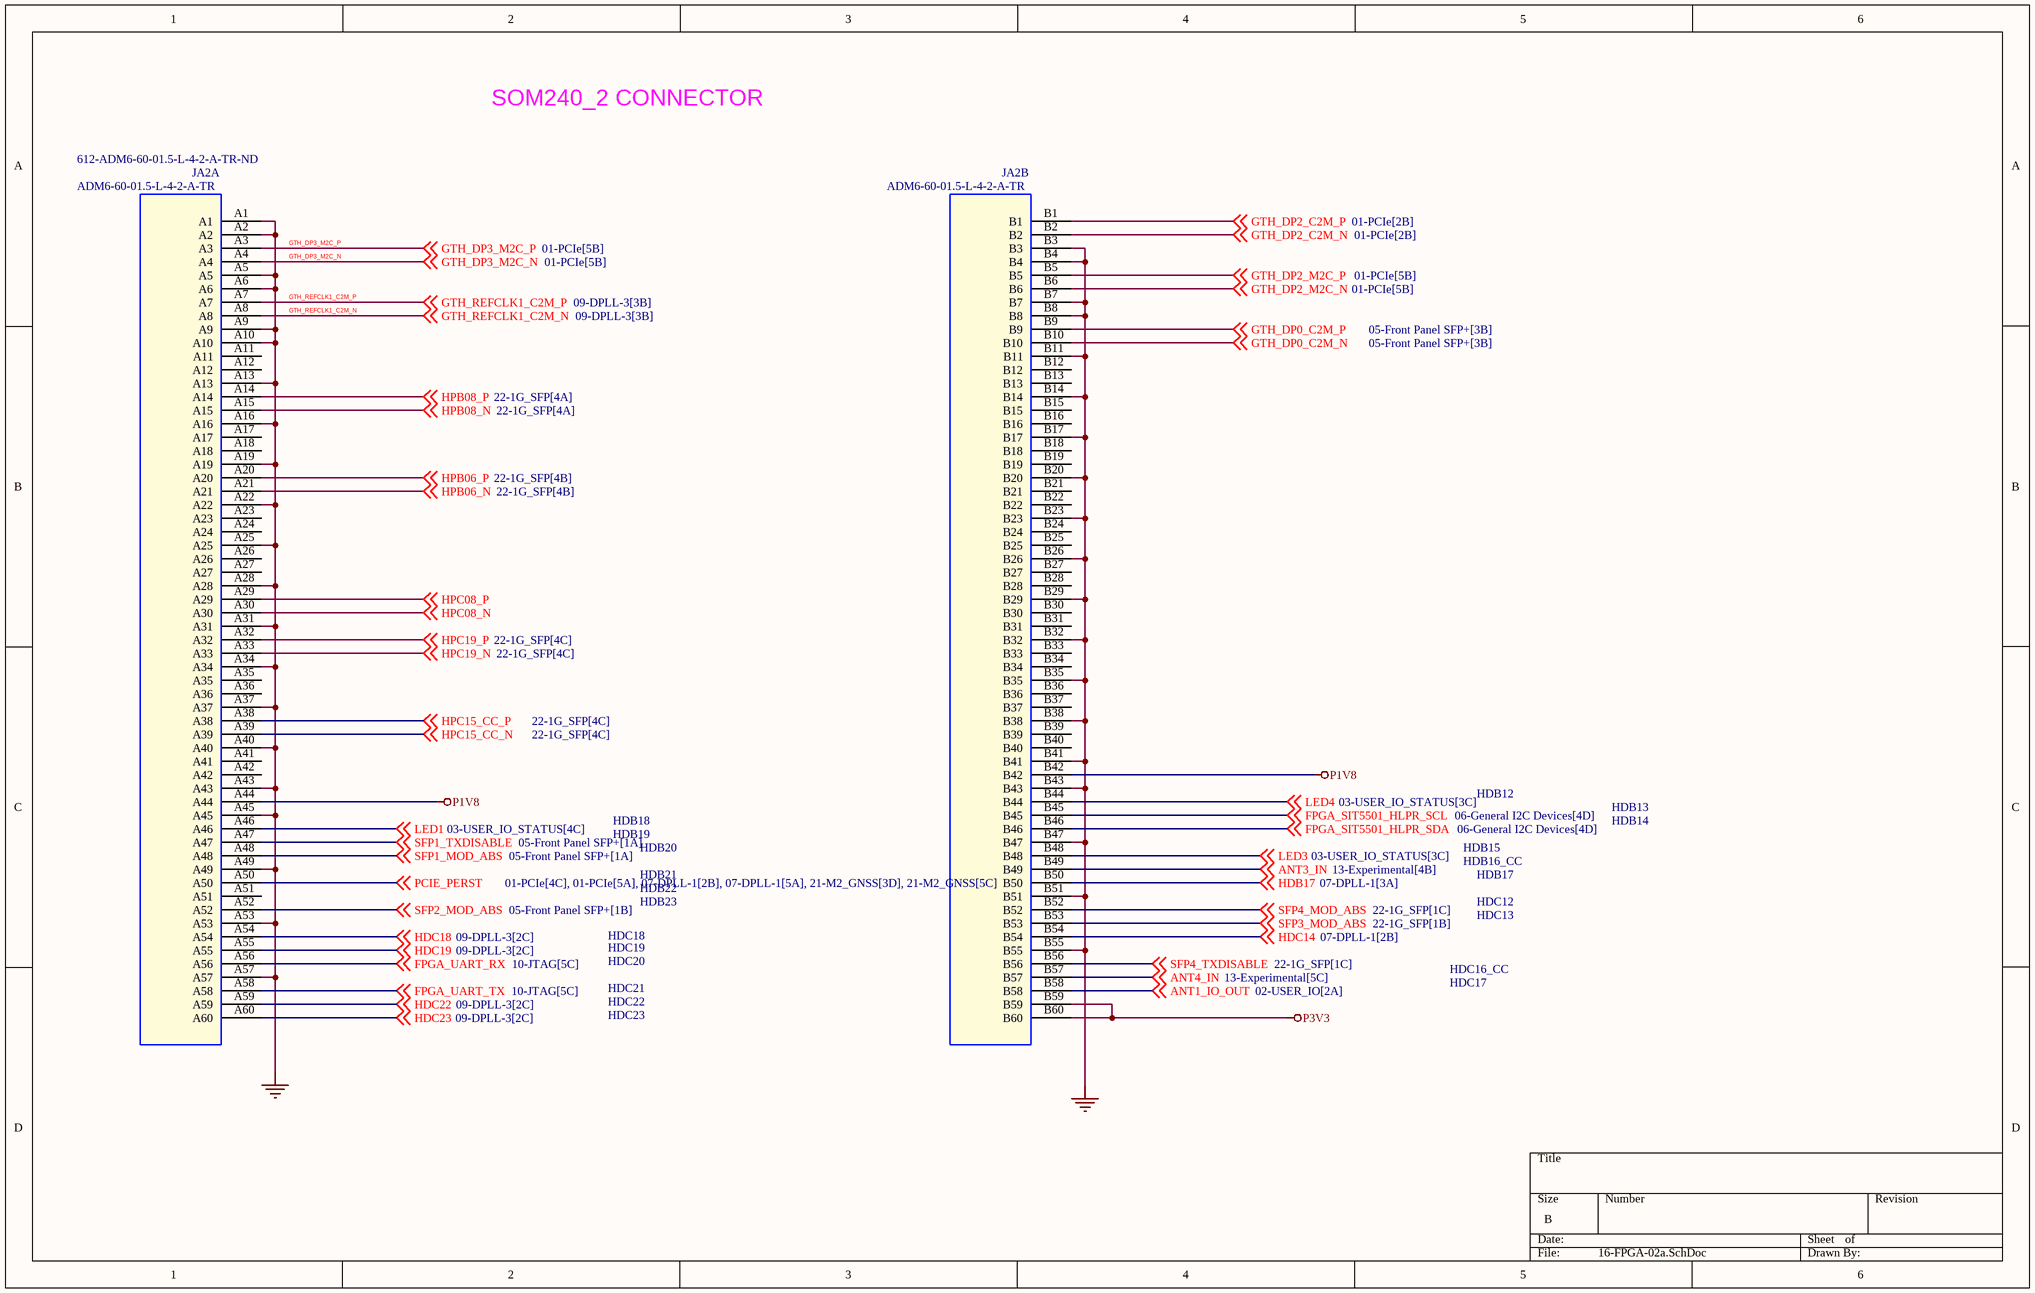
[diagram p16: 16-FPGA-02a.SchDoc]

### Parts
JA2  ADM6-60-01.5-L-4-2-A-TR  Supplier Part Number 1: 612-ADM6-60-01.5-L-4-2-A-TR-ND  [CON_SAMTEC_ADM6_60_4]  (parts A,B of 4)

### Nets
GND: JA2.A1 JA2.A2 JA2.A5 JA2.A6 JA2.A9 JA2.A10 JA2.A13 JA2.A16 JA2.A19 JA2.A22 JA2.A25 JA2.A28 JA2.A31 JA2.A34 JA2.A37 JA2.A40 JA2.A43 JA2.A45 JA2.A49 JA2.A53 JA2.A57 JA2.B3 JA2.B4 JA2.B7 JA2.B8 JA2.B11 JA2.B14 JA2.B17 JA2.B20 JA2.B23 JA2.B26 JA2.B29 JA2.B32 JA2.B35 JA2.B38 JA2.B41 JA2.B43 JA2.B47 JA2.B51 JA2.B55
P1V8: JA2.A44 JA2.B42
P3V3: JA2.B59 JA2.B60
ANT1_IO_OUT: JA2.B58 ; off-sheet ANT1_IO_OUT
ANT3_IN: JA2.B49 ; off-sheet ANT3_IN
ANT4_IN: JA2.B57 ; off-sheet ANT4_IN
FPGA_SIT5501_HLPR_SCL: JA2.B45 ; off-sheet FPGA_SIT5501_HLPR_SCL
FPGA_SIT5501_HLPR_SDA: JA2.B46 ; off-sheet FPGA_SIT5501_HLPR_SDA
FPGA_UART_RX: JA2.A56 ; off-sheet FPGA_UART_RX
FPGA_UART_TX: JA2.A58 ; off-sheet FPGA_UART_TX
GTH_DP0_C2M_N: JA2.B10 ; off-sheet GTH_DP0_C2M_N
GTH_DP0_C2M_P: JA2.B9 ; off-sheet GTH_DP0_C2M_P
GTH_DP2_C2M_N: JA2.B2 ; off-sheet GTH_DP2_C2M_N
GTH_DP2_C2M_P: JA2.B1 ; off-sheet GTH_DP2_C2M_P
GTH_DP2_M2C_N: JA2.B6 ; off-sheet GTH_DP2_M2C_N
GTH_DP2_M2C_P: JA2.B5 ; off-sheet GTH_DP2_M2C_P
GTH_DP3_M2C_N: JA2.A4 ; off-sheet GTH_DP3_M2C_N
GTH_DP3_M2C_P: JA2.A3 ; off-sheet GTH_DP3_M2C_P
GTH_REFCLK1_C2M_N: JA2.A8 ; off-sheet GTH_REFCLK1_C2M_N
GTH_REFCLK1_C2M_P: JA2.A7 ; off-sheet GTH_REFCLK1_C2M_P
HDB17: JA2.B50 ; off-sheet HDB17
HDC14: JA2.B54 ; off-sheet HDC14
HDC18: JA2.A54 ; off-sheet HDC18
HDC19: JA2.A55 ; off-sheet HDC19
HDC22: JA2.A59 ; off-sheet HDC22
HDC23: JA2.A60 ; off-sheet HDC23
HPB06_N: JA2.A21 ; off-sheet HPB06_N
HPB06_P: JA2.A20 ; off-sheet HPB06_P
HPB08_N: JA2.A15 ; off-sheet HPB08_N
HPB08_P: JA2.A14 ; off-sheet HPB08_P
HPC08_N: JA2.A30 ; off-sheet HPC08_N
HPC08_P: JA2.A29 ; off-sheet HPC08_P
HPC15_CC_N: JA2.A39 ; off-sheet HPC15_CC_N
HPC15_CC_P: JA2.A38 ; off-sheet HPC15_CC_P
HPC19_N: JA2.A33 ; off-sheet HPC19_N
HPC19_P: JA2.A32 ; off-sheet HPC19_P
LED1: JA2.A46 ; off-sheet LED1
LED3: JA2.B48 ; off-sheet LED3
LED4: JA2.B44 ; off-sheet LED4
PCIE_PERST: JA2.A50 ; off-sheet PCIE_PERST
SFP1_MOD_ABS: JA2.A48 ; off-sheet SFP1_MOD_ABS
SFP1_TXDISABLE: JA2.A47 ; off-sheet SFP1_TXDISABLE
SFP2_MOD_ABS: JA2.A52 ; off-sheet SFP2_MOD_ABS
SFP3_MOD_ABS: JA2.B53 ; off-sheet SFP3_MOD_ABS
SFP4_MOD_ABS: JA2.B52 ; off-sheet SFP4_MOD_ABS
SFP4_TXDISABLE: JA2.B56 ; off-sheet SFP4_TXDISABLE

Not connected (* = marked no-connect by the designer): JA2 A11 A12 A17 A18 A23 A24 A26 A27 A35 A36 A41 A42 A51 B12 B13 B15 B16 B18 B19 B21 B22 B24 B25 B27 B28 B30 B31 B33 B34 B36 B37 B39 B40

### Notes on the sheet
- SOM240_2 CONNECTOR
- HDB18
- HDB19
- HDB12
- HDB14
- HDB13
- HDB20
- HDB21
- HDB22
- HDB23
- HDB16_CC
- HDB15
- HDB17
- HDC12
- HDC18
- HDC19
- HDC20
- HDC16_CC
- HDC13
- HDC21
- HDC22
- HDC23
- HDC17

### Library data of the parts
JA2 = SAMTEC-ADx6-60X4: Conn Rcpt Male Vert 240 Pos 4x60 0.635mm P Black SMT; Manufacturer: Samtec Inc.; Agile Part Number: CON-00383-01; SPLIT_INST: TRUE; SWAP_INFO: (S1+S2+S3+S4); Barcode: 40000092; Pitch: 0.025" (0.64mm); Datasheet: http://suddendocs.samtec.com/catalog_english/adf6.pdf; Manufacturer PN: ADM6-60-01.5-L-4-2-A-TR; PCB Footprint: CON_SAMTEC_ADM6_60_4; Part Type: CONNECTOR; Number of Pins: 240; CIP Link: http://xsjbrdwin1/CIP-E/Component/Index/All?pn=40000092; Supplier 1: Digi-Key